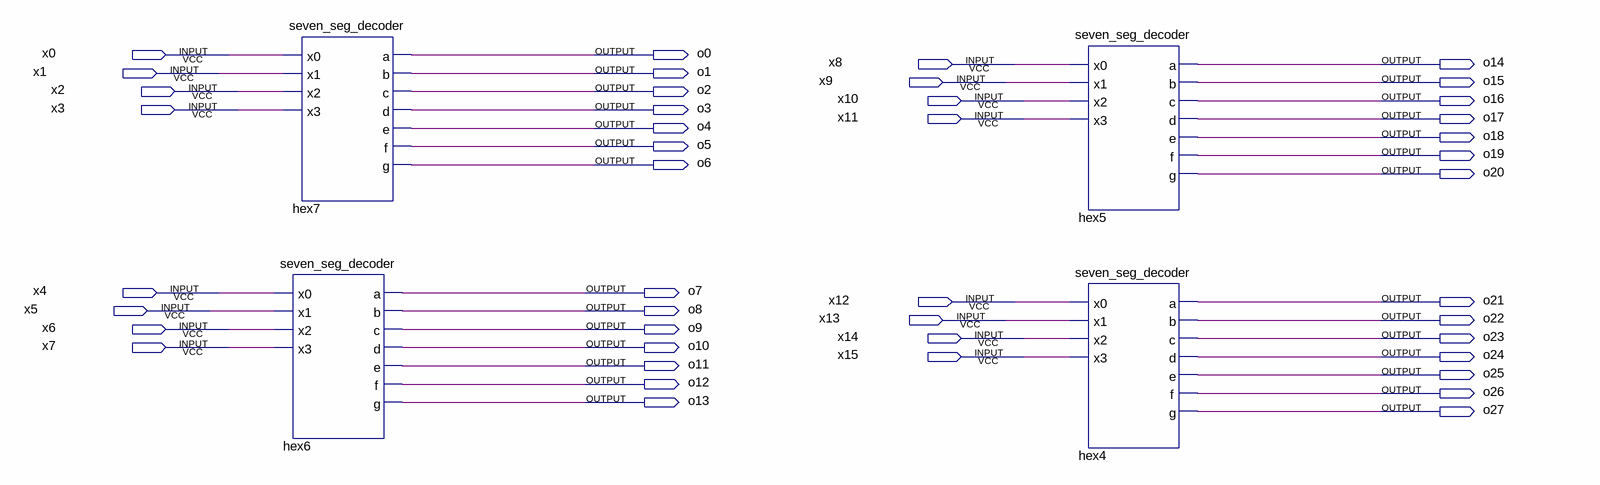
[diagram p0: schematic sheet]
// Quartus schematic Lab05step1.bdf as structural Verilog: 4 symbols, 44 pins
module Lab05step1 (
  input  x0,
  input  x8,
  input  x1,
  input  x9,
  input  x2,
  input  x10,
  input  x3,
  input  x11,
  input  x4,
  input  x12,
  input  x5,
  input  x13,
  input  x6,
  input  x14,
  input  x7,
  input  x15,
  output o0,
  output o14,
  output o1,
  output o15,
  output o2,
  output o16,
  output o3,
  output o17,
  output o4,
  output o18,
  output o5,
  output o19,
  output o6,
  output o20,
  output o7,
  output o21,
  output o8,
  output o22,
  output o9,
  output o23,
  output o10,
  output o24,
  output o11,
  output o25,
  output o12,
  output o26,
  output o13,
  output o27
);

  seven_seg_decoder hex7 (.x0(x0), .x1(x1), .x2(x2), .x3(x3), .a(o0), .b(o1), .c(o2), .d(o3), .e(o4), .f(o5), .g(o6));
  seven_seg_decoder hex6 (
    .x0(x4), .x1(x5), .x2(x6), .x3(x7), .a(o7), .b(o8), .c(o9), .d(o10), .e(o11), .f(o12), .g(o13));
  seven_seg_decoder hex5 (
    .x0(x8), .x1(x9), .x2(x10), .x3(x11), .a(o14), .b(o15), .c(o16), .d(o17), .e(o18), .f(o19), .g(o20));
  seven_seg_decoder hex4 (
    .x0(x12), .x1(x13), .x2(x14), .x3(x15), .a(o21), .b(o22), .c(o23), .d(o24), .e(o25), .f(o26), .g(o27));
endmodule
